# Altium schematic sheet 0183_EC POWER RAIL GENE.SchDoc
size A3
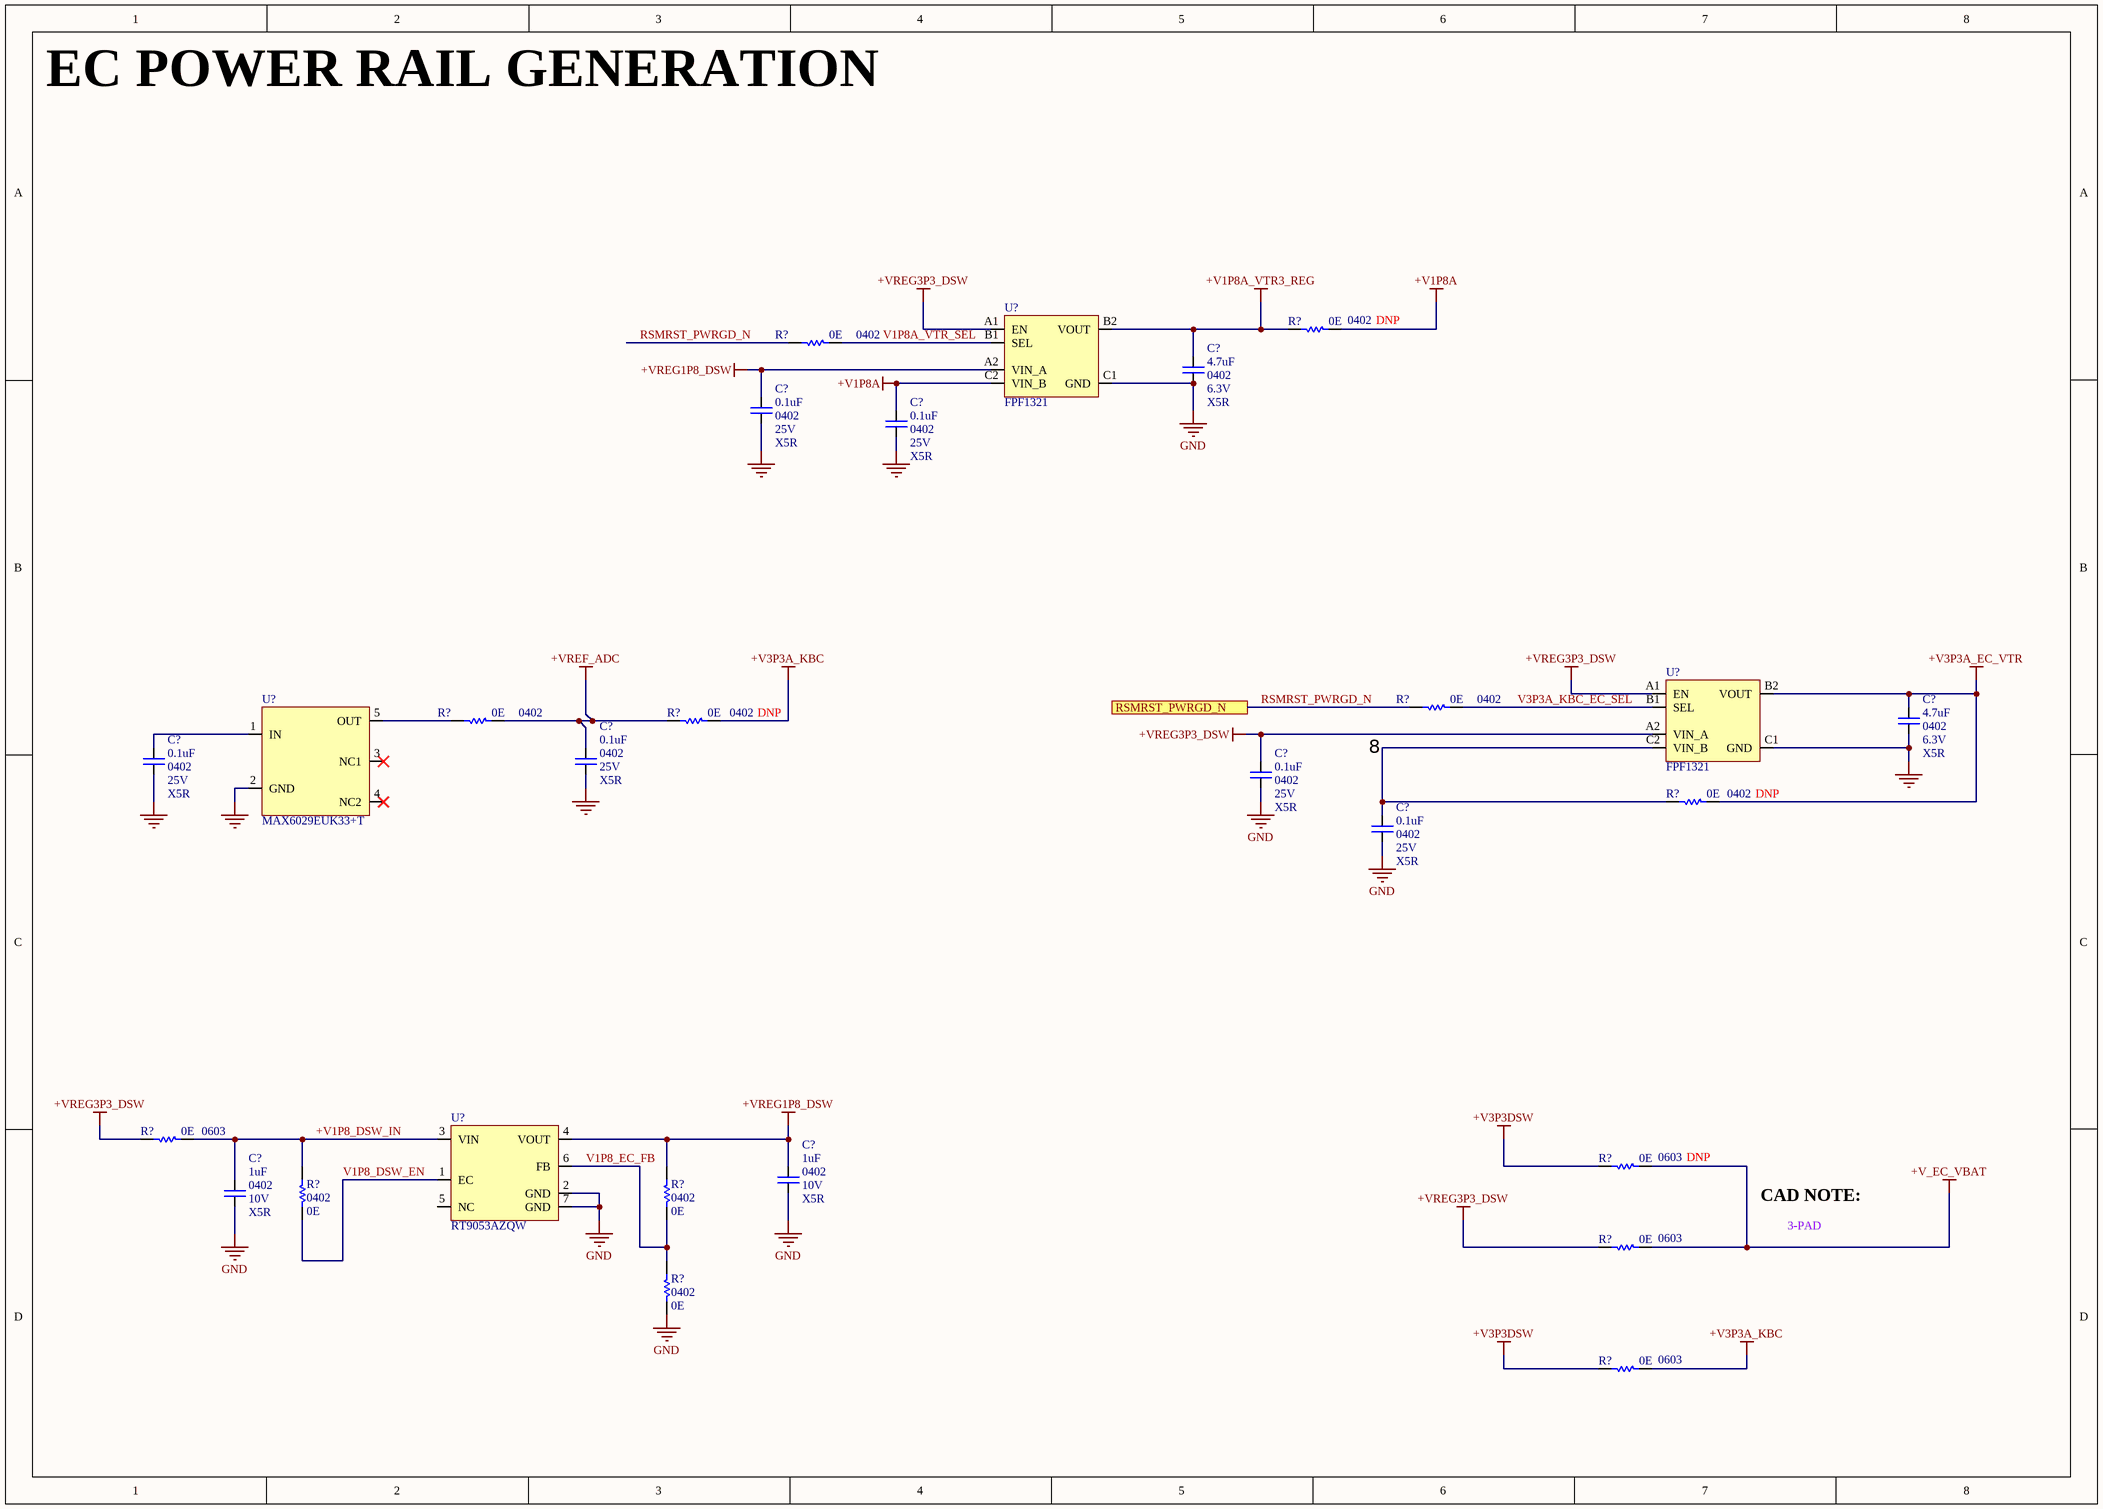
[diagram p0: 0183_EC POWER RAIL GENE.SchDoc]

## Parts
(Parts that share a designator on the sheet are numbered #1, #2 ... from top to bottom, then left to right.)
C?#1  value 4.7uF  Case/Package: 0402  Voltage: 6.3V  Dielectric: X5R  [CAPC0402]
C?#2  value 0.1uF  Case/Package: 0402  Voltage: 25V  Dielectric: X5R  [CAPC0402]
C?#3  value 0.1uF  Case/Package: 0402  Voltage: 25V  Dielectric: X5R  [CAPC0402]
C?#4  value 4.7uF  Case/Package: 0402  Voltage: 6.3V  Dielectric: X5R  [CAPC0402]
C?#5  value 0.1uF  Case/Package: 0402  Voltage: 25V  Dielectric: X5R  [CAPC0402]
C?#6  value 0.1uF  Case/Package: 0402  Voltage: 25V  Dielectric: X5R  [CAPC0402]
C?#7  value 0.1uF  Case/Package: 0402  Voltage: 25V  Dielectric: X5R  [CAPC0402]
C?#8  value 0.1uF  Case/Package: 0402  Voltage: 25V  Dielectric: X5R  [CAPC0402]
C?#9  value 1uF  Case/Package: 0402  Voltage: 10V  Dielectric: X5R  [CAPC0402]
C?#10  value 1uF  Case/Package: 0402  Voltage: 10V  Dielectric: X5R  [CAPC0402]
R?#1  value 0E  Case/Package: 0402  [RESC0402]  (hidden comment: Res)
R?#2  value 0E  Case/Package: 0402  [RESC0402]  (hidden comment: Res)
R?#3  value 0E  Case/Package: 0402  [RESC0402]  (hidden comment: Res)
R?#4  value 0E  Case/Package: 0402  [RESC0402]  (hidden comment: Res)
R?#5  value 0E  Case/Package: 0402  [RESC0402]  (hidden comment: Res)
R?#6  value 0E  Case/Package: 0402  [RESC0402]  (hidden comment: Res)
R?#7  value 0E  Case/Package: 0603  [RESC0603]  (hidden comment: Res)
R?#8  value 0E  Case/Package: 0603  [RESC0603]  (hidden comment: Res)
R?#9  value 0E  Case/Package: 0402  [RESC0402]  (hidden comment: Res)
R?#10  value 0E  Case/Package: 0402  [RESC0402]  (hidden comment: Res)
R?#11  value 0E  Case/Package: 0603  [RESC0603]  (hidden comment: Res)
R?#12  value 0E  Case/Package: 0402  [RESC0402]  (hidden comment: Res)
R?#13  value 0E  Case/Package: 0603  [RESC0603]  (hidden comment: Res)
U?#1  FPF1321
U?#2  FPF1321
U?#3  MAX6029EUK33+T
U?#4  RT9053AZQW

## Ports
RSMRST_PWRGD_N

## Nets
+V1P8A: C?#3.2 R?#1.2 U?#1.C2(VIN_B)
+V1P8A_VTR3_REG: C?#1.2 R?#1.1 U?#1.B2(VOUT)
+V3P3A_EC_VTR: C?#4.2 R?#6.2 U?#2.B2(VOUT)
+V3P3A_KBC: R?#5.2 R?#13.2
+V3P3DSW: R?#8.1 R?#13.1
+V_EC_VBAT: R?#8.2 R?#11.2
+VREF_ADC: C?#6.2 R?#4.2 R?#5.1
+VREG1P8_DSW: C?#2.2 C?#9.2 R?#10.2 U?#1.A2(VIN_A) U?#4.4(VOUT)
+VREG3P3_DSW: C?#7.2 R?#7.2 R?#11.1 U?#1.A1(EN) U?#2.A1(EN) U?#2.A2(VIN_A)
GND: C?#1.1 C?#2.1 C?#3.1 C?#4.1 C?#5.1 C?#6.1 C?#7.1 C?#8.1 C?#9.1 C?#10.1 R?#12.1 U?#1.C1(GND) U?#2.C1(GND) U?#3.2(GND) U?#4.2(GND) U?#4.7(GND)
+V1P8_DSW_IN: C?#10.2 R?#7.1 R?#9.2 U?#4.3(VIN)
RSMRST_PWRGD_N: R?#2.1 R?#3.1 ; port RSMRST_PWRGD_N
V1P8_DSW_EN: R?#9.1 U?#4.1(EC)
V1P8_EC_FB: R?#10.1 R?#12.2 U?#4.6(FB)
V1P8A_VTR_SEL: R?#2.2 U?#1.B1(SEL)
V3P3A_KBC_EC_SEL: R?#3.2 U?#2.B1(SEL)
NetC?#5_2: C?#5.2 U?#3.1(IN)
NetC?#8_2: C?#8.2 R?#6.1 U?#2.C2(VIN_B)
NetR?#4_1: R?#4.1 U?#3.5(OUT)

Not connected (* = marked no-connect by the designer): U?#3 3(NC1)* 4(NC2)*; U?#4 5(NC)

## Notes on the sheet
- EC POWER RAIL GENERATION
- 8
- CAD NOTE:
- 3-PAD

## Library data of the parts
C?#1 C?#4 = Cap: CAP CER 4.7uF 6.3V X5R 0402
C?#2 C?#3 C?#5-C?#8 = Cap: CAP CER 0.1uF 25V X5R 0402
C?#9 C?#10 = Cap: CAP CER 1uF 25V X5R 0402
R?#1-R?#6 R?#9 R?#10 R?#12 = Res: Thick Film Resistor -  0ohm, 1%, 0402
  R?#1 R?#5 R?#6: DNP: DNP
R?#7 R?#8 = Res: Thick Film Resistor -  0ohm, 1%, 0603
  R?#8: DNP: DNP
R?#11 R?#13 = Res: Thick Film Resistor -  0ohm, 1%,0603